# Altium schematic sheet led.SchDoc
size 292 x 204 mm; ProjectSection: Set ProjectSection in Document Parameters; PageSetup: Record=PageOptions|CenterHorizontal=True|CenterVertical=True|PrintScale=1.00|XCorrection=1.00|YCorrection=1.00|PrintKind=1|BorderSize=5000000|LeftOffset=0|BottomOffset=0|Orientation=2|PaperLength=1000|PaperWidth=1000|Scale=100|PaperSource=7|PrintQuality=1200|MediaType=1|DitherType=10|PaperKind=A4|PrintScaleMode=1
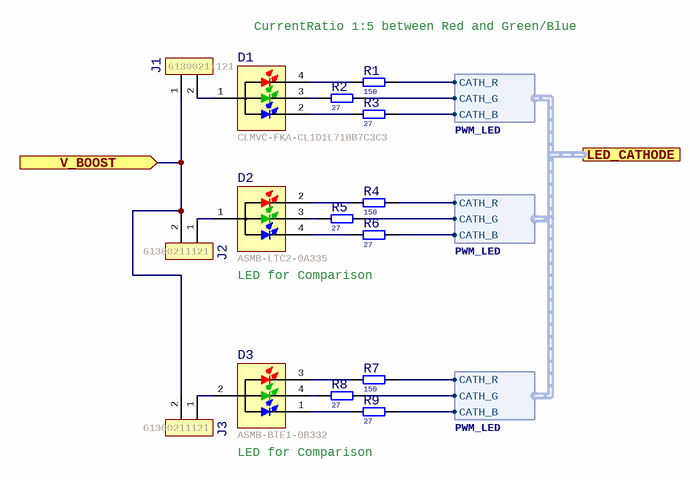
[diagram p0: led.SchDoc]

## Parts
D1  Manufacturer P/N: CLMVC-FKA-CL1D1L71BB7C3C3  [LED-RGB-PLCC4-2020-CLMVx-FKA]  (hidden comment: DIO-LED-RGB-CA-PIN1-CLMVx-FKA)
D2  Manufacturer P/N: ASMB-LTC2-0A335  [LED-RGB-2121-ASMB-LTB]  (hidden comment: DIO-LED-RGB-CA-PIN1)
D3  Manufacturer P/N: ASMB-BTE1-0B332  [LED-RGB-3228-ASMB-BTE]  (hidden comment: DIO-LED-RGB-CA-PIN2-ASMB-BTE1)
J1  Manufacturer P/N: 61300211121  [CON-02-1-254-V-T-PFL-Jumper]  (hidden comment: CON-02)
J2  Manufacturer P/N: 61300211121  [CON-02-1-254-V-T-PFL-Jumper]  (hidden comment: CON-02)
J3  Manufacturer P/N: 61300211121  [CON-02-1-254-V-T-PFL-Jumper]  (hidden comment: CON-02)
R1  value 150  [1608R]  (hidden comment: RES)
R2  value 27  [1608R]  (hidden comment: RES)
R3  value 27  [1608R]  (hidden comment: RES)
R4  value 150  [1608R]  (hidden comment: RES)
R5  value 27  [1608R]  (hidden comment: RES)
R6  value 27  [1608R]  (hidden comment: RES)
R7  value 150  [1608R]  (hidden comment: RES)
R8  value 27  [1608R]  (hidden comment: RES)
R9  value 27  [1608R]  (hidden comment: RES)

## Ports
LED_CATHODE (harness PWM_LED), V_BOOST (in)

## Harnesses
PWM_LED: CATH_R, CATH_B, CATH_G

## Nets
V_BOOST: J1.1 J2.2 J3.2 ; port V_BOOST
NetD1_1: D1.1(Anode) J1.2
NetD1_2: D1.2(B) R3.1
NetD1_3: D1.3(G) R2.1
NetD1_4: D1.4(R) R1.1
NetD2_1: D2.1(Anode) J2.1
NetD2_2: D2.2(R) R4.1
NetD2_3: D2.3(G) R5.1
NetD2_4: D2.4(B) R6.1
NetD3_1: D3.1(B) R9.1
NetD3_2: D3.2(Anode) J3.1
NetD3_3: D3.3(R) R7.1
NetD3_4: D3.4(G) R8.1
NetR1_2: R1.2 R4.2 R7.2 ; port LED_CATHODE.CATH_R
NetR2_2: R2.2 R5.2 R8.2 ; port LED_CATHODE.CATH_G
NetR3_2: R3.2 R6.2 R9.2 ; port LED_CATHODE.CATH_B

## Notes on the sheet
- CurrentRatio 1:5 between Red and Green/Blue
- LED for Comparison
- Project
- Customer
- File Name
- Part
- Section
- Revision (File)
- Variant
- Revision (Project)
- Date
- Sheet
- Contronix GmbH
- Nizzastr. 6, 01445 Radebeul

## Library data of the parts
D1 = LED-RGB-CLMVC-FKA-PLCC4: RGB LED PLCC-4 2x2mm Common Anode; Manufacturer: Cree Inc; hasAltManufacturer: 0; Contronix P/N: DR7TDL; NozzleType: 711/911; FeederType: Tape 8mm; FeederPitch: 4mm; NumberOfPins: 4; NumberOfRows: 2; Design Item Id: LED-RGB-CLMVC-FKA-PLCC4; Stock: 15; Price: 0,17; Price (€): 0,17; ComponentLink1Description: Manufacturer Datasheet; ComponentLink1URL: https://www.cree.com/led-components/media/documents/1273-CLMVC-FKA.pdf; Supplier 1: Digi-Key; Supplier Part Number 1: CLMVC-FKA-CL1D1L71BB7C3C3CT-ND; Supplier 2: Mouser; Supplier Part Number 2: 941-CLMVCFKACL1D1L71; Created: 21.03.2018 20:33:27; Modified: 30.06.2020 13:58:57; Obsolete: 0; Color: RGB; isMulticolor: 0; MountingType: SMT; Manufacturer Part Number: CLMVC-FKA-CL1D1L71BB7C3C3
D2 = LED-RGB-2121-ASMB-LTB: RGB LED Red 621/Green 522/Blue 468, 2.1x2.1mm PLCC-4; Manufacturer: Broadcom Limited; hasAltManufacturer: 0; Remark: Alternative (andere Farbbelegung!): Dialight 598-8710-307F (Digi-Key: 350-2096-1-ND); NumberOfPins: 4; NumberOfRows: 2; PackageCNTX: 2121; Color: Red/Green/Blue; ViewingAngle: 110; isMulticolor: 1; Design Item Id: LED-RGB-2121-ASMB-LTC; Manufacturer Part Number: ASMB-LTC2-0A335; Price: 0,42; Price (€): 0,42; autIdem: 0; A I: 0; ComponentLink1Description: Manufacturer Datasheet; ComponentLink1URL: https://docs.broadcom.com/doc/ASMB-LTB2-0A333-DS; Created: 24.11.2020 08:49:26; Modified: 24.11.2020 11:03:06; Obsolete: 0; PackageManufacturer: 2121; MountingType: SMT
D3 = LED-RGB-3228-ASMB-BTE: RGB LED Red 622/Green 529/Blue 469, 3.2x2.8mm PLCC-4; Manufacturer: Broadcom Limited; hasAltManufacturer: 0; Contronix P/N: DXD6S6; Remark: Alternative (andere Farbbelegung!): Dialight 598-8710-307F (Digi-Key: 350-2096-1-ND); NumberOfPins: 4; NumberOfRows: 2; PackageCNTX: 3228; Color: Red/Green/Blue; isMulticolor: 1; Design Item Id: LED-RGB-3228-ASMB-BTE; Manufacturer Part Number: ASMB-BTE1-0B332; Price: 0,42; Price (€): 0,42; autIdem: 0; A I: 0; ComponentLink1Description: Manufacturer Datasheet; ComponentLink1URL: https://docs.broadcom.com/doc/AV02-4236EN; Supplier 1: Digi-Key; Supplier Part Number 1: 516-3964-1-ND; Supplier 2: Mouser; Supplier Part Number 2: 630-ASMB-BTE1-0B332; Supplier 3: Farnell; Supplier Part Number 3: 2401107; Created: 24.11.2020 17:01:03; Modified: 24.11.2020 17:01:03; Obsolete: 0; PackageManufacturer: 3228; MountingType: SMT
J1-J3 = CON-02-1-254-V-T-PFL-Jumper: Stiftleiste, 2-polig, 2.54mm, +Jumper; Manufacturer: Würth Elektronik; hasAltManufacturer: 0; Contronix P/N: JT919C; NumberOfPins: 2; NumberOfRows: 1; Pitch: 2,54; Rev: =VersionControl_RevNumber; Design Item Id: CON-02-1-254-V-T-PFL-Jumper; Manufacturer Part Number: 61300211121; Stock: 43; Price: 0,05; Price (€): 0,05; autIdem: 0; A I: 0; ComponentLink1Description: Manufacturer Datasheet; ComponentLink1URL: http://www.molex.com/datasheets/pdf/0879140216_PCB_HEADERS.pdf; Supplier 1: Digi-Key; Supplier Part Number 1: 732-5315-ND; Supplier 2: Mouser; Supplier Part Number 2: 710-61300211121; Modified: 25.07.2019 11:36:41; Obsolete: 0; MountingType: THT
R1 R4 R7 = RES-150R-1%-0.125W-1608: SMD resistor; Manufacturer: KOA Speer Electronics, Inc.; Manufacturer P/N: RK73H1JTTD1500F; hasAltManufacturer: 0; Contronix P/N: R7WPV7; autIdem: 255; NozzleType: 711/911; FeederType: Tape 8mm; FeederPitch: 4mm; PackageCNTX: 1608; NumberOfPins: 2; NumberOfRows: 1; Tolerance: 1%; Power: 0,125; Design Item Id: RES-150R-1%-0.125W-1608; Manufacturer Part Number: RK73H1JTTD1500F; Stock: 17; Price: 0,08; Price (€): 0,08; A I: 255; Supplier 1: Digi-Key; Supplier Part Number 1: 2019-RK73H1JTTD1500FCT-ND; Supplier 2: Mouser; Supplier Part Number 2: 660-RK73H1JTTD1500F; Created: 17.09.2020 14:11:09; Modified: 17.09.2020 14:14:26; Obsolete: 0; PackageManufacturer: 1608; Resistance: 150; ResistanceSI: 150; MountingType: SMT
R2 R3 R5 R6 R8 R9 = RES-27R-1%-0.1W-1608: SMD resistor; Manufacturer: Stackpole Electronics Inc; Manufacturer P/N: RMCF0603FT27R0; hasAltManufacturer: 0; Contronix P/N: RAE6H8; autIdem: 255; NozzleType: 711/911; FeederType: Tape 8mm; FeederPitch: 4mm; PackageCNTX: 1608; NumberOfPins: 2; NumberOfRows: 1; Tolerance: 1%; Power: 0,1; Design Item Id: RES-27R-1%-0.1W-1608; Manufacturer Part Number: RMCF0603FT27R0; Stock: 3984; Price: 0,003; Price (€): 0,003; A I: 255; ComponentLink1Description: Manufacturer Datasheet; ComponentLink1URL: http://www.seielect.com/Catalog/SEI-RMCF_RMCP.pdf; Supplier 1: Digi-Key; Supplier Part Number 1: RMCF0603FT27R0CT-ND; Created: 23.08.2012 12:04:38; Modified: 23.10.2019 11:35:16; Obsolete: 0; PackageManufacturer: 1608; Resistance: 27; ResistanceSI: 27; MountingType: SMT